# Altium schematic sheet sensores.SchDoc
size A4
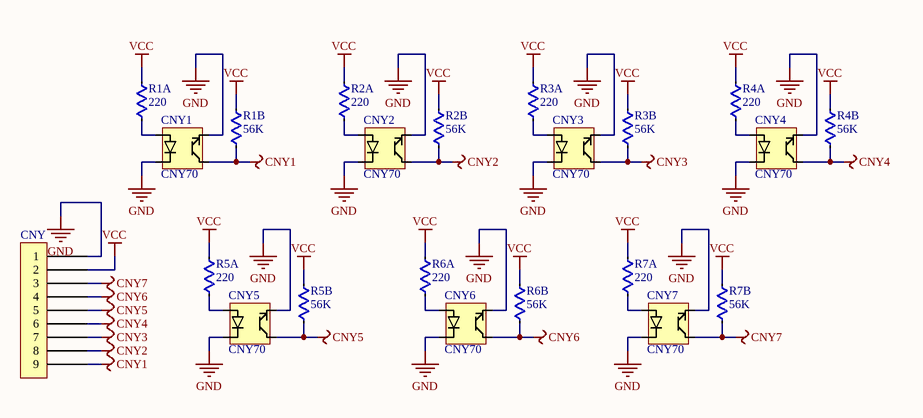
[diagram p0: sensores.SchDoc]

## Parts
CNY  (no value)  [HEADER 1x9]
CNY1  CNY70  [CNY70]
CNY2  CNY70  [CNY70]
CNY3  CNY70  [CNY70]
CNY4  CNY70  [CNY70]
CNY5  CNY70  [CNY70]
CNY6  CNY70  [CNY70]
CNY7  CNY70  [CNY70]
R1A  value 220  [RES-Axial-400mil]
R1B  value 56K  [RES-Axial-400mil]
R2A  value 220  [RES-Axial-400mil]
R2B  value 56K  [RES-Axial-400mil]
R3A  value 220  [RES-Axial-400mil]
R3B  value 56K  [RES-Axial-400mil]
R4A  value 220  [RES-Axial-400mil]
R4B  value 56K  [RES-Axial-400mil]
R5A  value 220  [RES-Axial-400mil]
R5B  value 56K  [RES-Axial-400mil]
R6A  value 220  [RES-Axial-400mil]
R6B  value 56K  [RES-Axial-400mil]
R7A  value 220  [RES-Axial-400mil]
R7B  value 56K  [RES-Axial-400mil]

## Nets
CNY1: CNY.9 CNY1.C R1B.1
CNY2: CNY.8 CNY2.C R2B.1
CNY3: CNY.7 CNY3.C R3B.1
CNY4: CNY.6 CNY4.C R4B.1
CNY5: CNY.5 CNY5.C R5B.1
CNY6: CNY.4 CNY6.C R6B.1
CNY7: CNY.3 CNY7.C R7B.1
GND: CNY.1 CNY1.E(7.5) CNY1.K CNY2.E(7.5) CNY2.K CNY3.E(7.5) CNY3.K CNY4.E(7.5) CNY4.K CNY5.E(7.5) CNY5.K CNY6.E(7.5) CNY6.K CNY7.E(7.5) CNY7.K
VCC: CNY.2 R1A.1 R1B.2 R2A.1 R2B.2 R3A.1 R3B.2 R4A.1 R4B.2 R5A.1 R5B.2 R6A.1 R6B.2 R7A.1 R7B.2
NetCNY1_A: CNY1.A R1A.2
NetCNY2_A: CNY2.A R2A.2
NetCNY3_A: CNY3.A R3A.2
NetCNY4_A: CNY4.A R4A.2
NetCNY5_A: CNY5.A R5A.2
NetCNY6_A: CNY6.A R6A.2
NetCNY7_A: CNY7.A R7A.2

## Library data of the parts
CNY = Header 1x9
R1A R1B R2A R2B R3A R3B R4A R4B R5A R5B R6A R6B R7A R7B = RES